# EAGLE design temp (EAGLE 6.4)
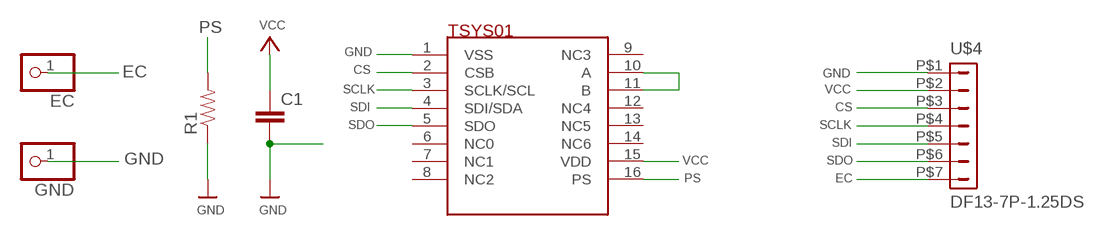
[diagram p0: schematic, sheet 1]

## Parts
C1  CAP0402-CAP  [0402-CAP]
EC  PINHD-1X1  [1X01]
GND  PINHD-1X1  [1X01]
R1  RESISTOR0402-RES  [0402-RES]
U$1  TSYS01  [QFN16]
U$4  DF13-7P-1.25DS  [DF13-7P-1.25DS]

## Nets
CS: U$1.2(CSB) U$4.P$3
EC: EC.1 U$4.P$7
GND: C1.2 GND.1 R1.1 U$1.1(VSS) U$4.P$1
N$1: U$1.10(A) U$1.11(B)
PS: R1.2 U$1.16(PS)
SCLK: U$1.3(SCLK/SCL) U$4.P$4
SDI: U$1.4(SDI/SDA) U$4.P$5
SDO: U$1.5(SDO) U$4.P$6
VCC: C1.1 U$1.15(VDD) U$4.P$2
Unconnected: U$1.6(NC0) U$1.7(NC1) U$1.8(NC2) U$1.9(NC3) U$1.12(NC4) U$1.13(NC5) U$1.14(NC6)

## Library data of the parts
C1 = capstone:CAP: Capacitor Standard 0603 ceramic capacitor, and 0.1" leaded capacitor.
EC GND = adafruit:PINHD-1X1: Pin header 1x1 for 0.1" spacing With round pins
R1 = capstone:RESISTOR: Resistor Basic schematic elements and footprints for 0603, 1206, and PTH resistors.
U$1 = capstone:TSYS01
U$4 = capstone:DF13-7P-1.25: DF13-7P 1.25mm Pitch Miniature Crimping Connector.

## Board
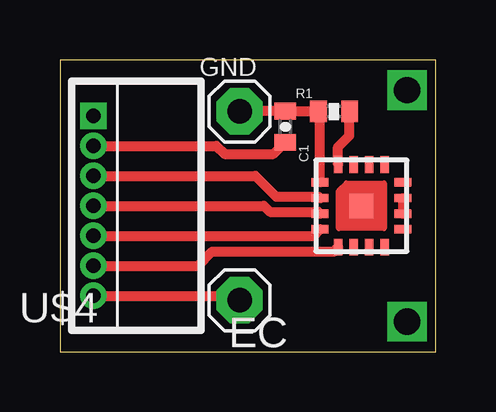
[diagram p1: board, top side]
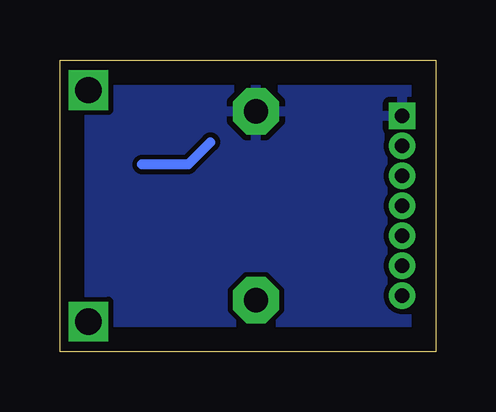
[diagram p2: board, bottom side, seen from below]

Size 15.67 x 12.18 mm. Coordinates in mm from the lower left corner, seen from the top.
Outline: 0,0 15.67,0 15.67,12.18 0,12.18 0,0
Copper layers (1*16): Top 0.035mm / dielectric 1.5mm / Bottom 0.035mm
Design rules "default": minimum track width 10mil, minimum drill 24mil, track to track 8mil, track to pad 8mil, pad to pad 8mil, via to via 8mil, smd to smd 8mil, copper to edge 40mil, drill to drill 8mil, minimum pad ring 10mil, minimum via ring 8mil, stop-mask expansion 4mil, vias tented up to drill 0mil, thermal gap 10mil

### Footprints (pad centres in the part's own frame; a part is rotated, then mirrored left to right if it is on the bottom)
0402-CAP = smd 0.7 x 0.9: 1 -0.65,0; 2 0.65,0
1X01 = drill 1.016 pad 1.93 octagon: 1 0,0
0402-RES = smd 0.7 x 0.9: 1 -0.65,0; 2 0.65,0
QFN16 = smd 0.7 x 0.35: 1 -1.725,0.975; 2 -1.725,0.325; 3 -1.725,-0.325; 4 -1.725,-0.975; 9 1.725,-0.975; 10 1.725,-0.325; 11 1.725,0.325; 12 1.725,0.975 | smd 0.35 x 0.7: 5 -0.975,-1.725; 6 -0.325,-1.725; 7 0.325,-1.725; 8 0.975,-1.725; 13 0.975,1.725; 14 0.325,1.725; 15 -0.325,1.725; 16 -0.975,1.725 | smd 1 x 1: TAB 0,0
DF13-7P-1.25DS = drill 0.6 pad 1.016 square: P$1 3.75,0 | drill 0.6 pad 1.016: P$2 2.5,0; P$3 1.25,0; P$4 0,0; P$5 -1.25,0; P$6 -2.5,0; P$7 -3.75,0

### Placement (x,y rotation side)
C1  9.4,9.4 90 top
EC  7.49,2.16 0 top
GND  7.49,10.03 0 top
R1  11.43,10.03 0 top
U$1  12.57,6.1 0 top
U$4  1.4,6.1 90 top

### Tracks (layer width: path | path; a pad name or v marks a point on that pad's centre or on a via)
CS
  Top 0.406: U$4.P$3 8.15,7.35 9.02,6.48 10.79,6.48 U$1.2
EC
  Top 0.406: U$4.P$7 7.31,2.35 EC.1
GND
  Top 0.406: U$1.1 10.85,9.97 R1.1 9.41,10.03 C1.2 7.51,10.05 GND.1
  pour Bottom: 0.13,12.06 15.62,12.06 15.62,0.13 0.13,0.13
N$1
  Top 0.406: U$1.11 U$1.10
N$3  (via drill 1.1)
  other vias: 14.48,10.92
N$4  (via drill 1.1)
  other vias: 14.48,1.27
PS
  Top 0.406: U$1.16 11.6,8.55 12.06,9.02 12.06,10.02 R1.2
SCLK
  Top 0.406: U$4.P$4 8.51,6.1 8.76,5.84 10.78,5.84 U$1.3
SDI
  Top 0.406: U$4.P$5 10.57,4.85 U$1.4
SDO
  Top 0.406: U$4.P$6 5.76,3.6 6.35,4.19 11.42,4.19 U$1.5
VCC
  Top 0.406: U$4.P$2 6.52,8.6 6.86,8.25 8.9,8.25 C1.1
  Bottom 0.406: C1.1 10.32,7.82 U$1.15